# EAGLE design Atividade-03 (EAGLE 9.6.2)
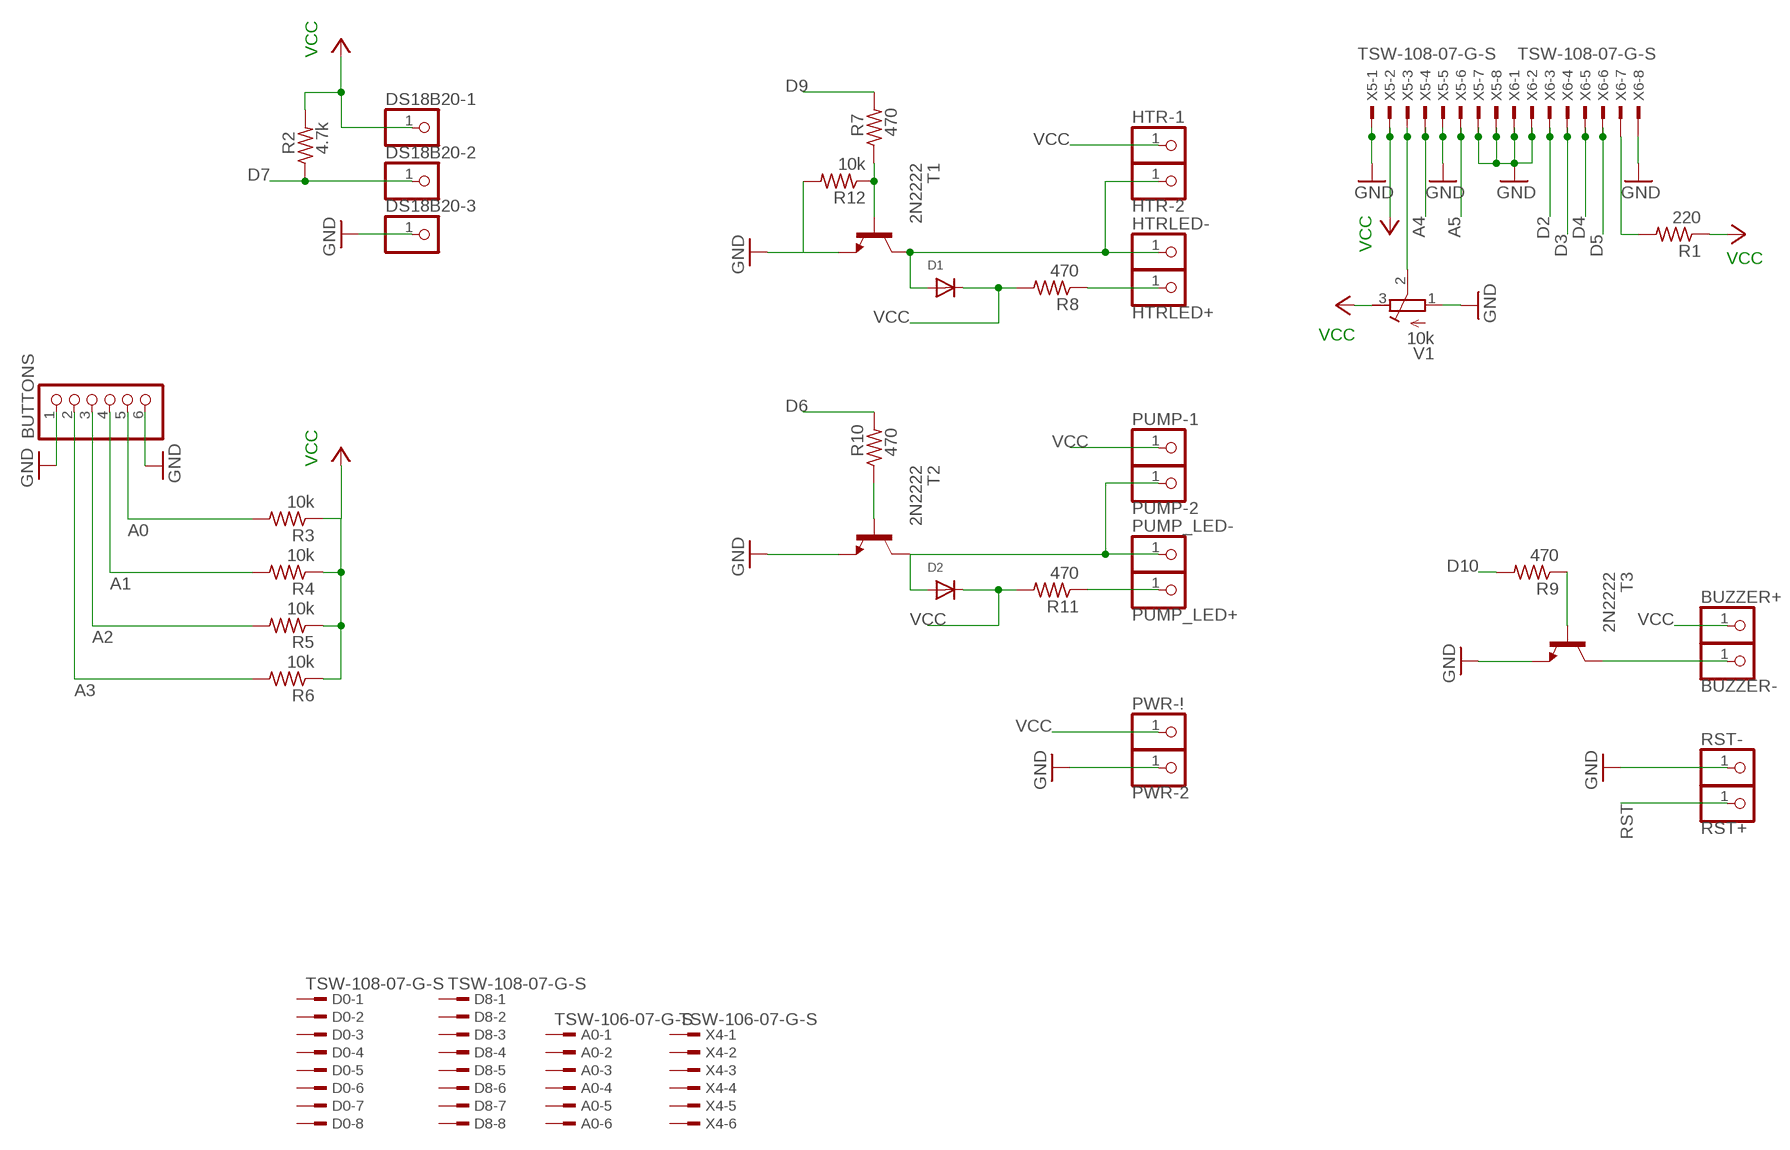
[diagram p0: schematic, sheet 1]

## Parts
A0  TSW-106-07-G-S  [TSW-106-XX-G-S]
BUTTONS  PINHD-1X6  [1X06]
BUZZER+  PINHD-1X1  [1X01]
BUZZER-  PINHD-1X1  [1X01]
D0  TSW-108-07-G-S  [TSW-108-XX-G-S]
D1  DIODEDO-1N4148  [DO-1N4148]
D2  DIODEDO-1N4148  [DO-1N4148]
D8  TSW-108-07-G-S  [TSW-108-XX-G-S]
DS18B20-1  PINHD-1X1  [1X01]
DS18B20-2  PINHD-1X1  [1X01]
DS18B20-3  PINHD-1X1  [1X01]
HTR-1  PINHD-1X1  [1X01]
HTR-2  PINHD-1X1  [1X01]
HTRLED+  PINHD-1X1  [1X01]
HTRLED-  PINHD-1X1  [1X01]
PUMP-1  PINHD-1X1  [1X01]
PUMP-2  PINHD-1X1  [1X01]
PUMP_LED+  PINHD-1X1  [1X01]
PUMP_LED-  PINHD-1X1  [1X01]
PWR-2  PINHD-1X1  [1X01]
PWR-!  PINHD-1X1  [1X01]
R1  220  R-US_0207/7  [0207/7]
R2  4.7k  R-US_0207/7  [0207/7]
R3  10k  R-US_0207/7  [0207/7]
R4  10k  R-US_0207/7  [0207/7]
R5  10k  R-US_0207/7  [0207/7]
R6  10k  R-US_0207/7  [0207/7]
R7  470  R-US_0207/7  [0207/7]
R8  470  R-US_0207/7  [0207/7]
R9  470  R-US_0207/7  [0207/7]
R10  470  R-US_0207/7  [0207/7]
R11  470  R-US_0207/7  [0207/7]
R12  10k  R-US_0207/7  [0207/7]
RST+  PINHD-1X1  [1X01]
RST-  PINHD-1X1  [1X01]
T1  2N2222  [TO92-EBC-OVAL]
T2  2N2222  [TO92-EBC-OVAL]
T3  2N2222  [TO92-EBC-OVAL]
V1  10k  R-TRIMM5W  [RTRIM5W]
X4  TSW-106-07-G-S  [TSW-106-XX-G-S]
X5  TSW-108-07-G-S  [TSW-108-XX-G-S]
X6  TSW-108-07-G-S  [TSW-108-XX-G-S]

## Nets
A0: BUTTONS.5 R3.2
A1: BUTTONS.4 R4.2
A2: BUTTONS.3 R5.2
A3: BUTTONS.2 R6.2
A4: X5.4
A5: X5.6
D2: X6.3
D3: X6.4
D4: X6.5
D5: X6.6
D6: R10.2
D7: DS18B20-2.1 R2.1
D9: R7.2
D10: R9.2
GND: BUTTONS.1 BUTTONS.6 DS18B20-3.1 PWR-2.1 R12.2 RST-.1 T1.E T2.E T3.E V1.1(A) X5.1 X5.5 X5.7 X5.8 X6.1 X6.2 X6.8
N$1: V1.2(S) X5.3
N$2: R7.1 R12.1 T1.B
N$3: D1.A D2.A HTR-2.1 HTRLED-.1 PUMP-2.1 PUMP_LED-.1 T1.C T2.C
N$4: R10.1 T2.B
N$5: HTRLED+.1 PUMP_LED+.1 R8.1 R11.1
N$6: R9.1 T3.B
N$7: BUZZER-.1 T3.C
N$8: R1.2 X6.7
RST: RST+.1
VCC: BUZZER+.1 D1.C D2.C DS18B20-1.1 HTR-1.1 PUMP-1.1 PWR-!.1 R1.1 R2.2 R3.1 R4.1 R5.1 R6.1 R8.2 R11.2 V1.3(E) X5.2
Unconnected: A0.1 A0.2 A0.3 A0.4 A0.5 A0.6 D0.1 D0.2 D0.3 D0.4 D0.5 D0.6 D0.7 D0.8 D8.1 D8.2 D8.3 D8.4 D8.5 D8.6 D8.7 D8.8 X4.1 X4.2 X4.3 X4.4 X4.5 X4.6

## Library data of the parts
A0 X4 = con-samtec:TSW-106-*-G-S: THROUGH-HOLE .025" SQ POST HEADER Source: Samtec TSW.pdf; MF: Samtec Inc.; MPN: TSW-106-07-G-S
BUTTONS = adafruit:PINHD-1X6: PIN HEADER
BUZZER+ BUZZER- DS18B20-1-DS18B20-3 HTR-1 HTR-2 HTRLED+ HTRLED- PUMP-1 PUMP-2 PUMP_LED+ PUMP_LED- PWR-2 PWR-! RST+ RST- = adafruit:PINHD-1X1: Pin header 1x1 for 0.1" spacing With round pins
D0 D8 X5 X6 = con-samtec:TSW-108-*-G-S: THROUGH-HOLE .025" SQ POST HEADER Source: Samtec TSW.pdf; MF: Samtec Inc.; MPN: TSW-108-07-G-S
D1 D2 = adafruit:DIODE: Diode SMADIODE - SMA Surface Mount Package 20V 1A Schottky Diode Digikey: 641-1014-6-ND DO-1N4148 - Through Hole Small Current Diode SOD-123 20V 1 A (.5mV Vf) Schottky Diode - Digikey: MBRX120TPMSCT-ND SOD-323 10V 570mA (.38mV Vf, 3ns) Schottky Diode - Digikey: ZLLS410CT-ND SOD-523 30V 30mA Schottky Diode (RB751S-40TE61) - Digikey: RB751S-40TE61CT-ND SOT23-R/W - SOT23 Package (R = Solder Paste/Reflow Ovens, W = Hand-Soldering) BAT54Film 40V 300mA - Digikey: 497-7162-1-ND
R1-R12 = resistor:R-US_: RESISTOR, American symbol
T1-T3 = adafruit:2N2222: NPN TRANSISTOR Big oval pads
V1 = resistor:R-TRIMM: Trimm resistor

## Board
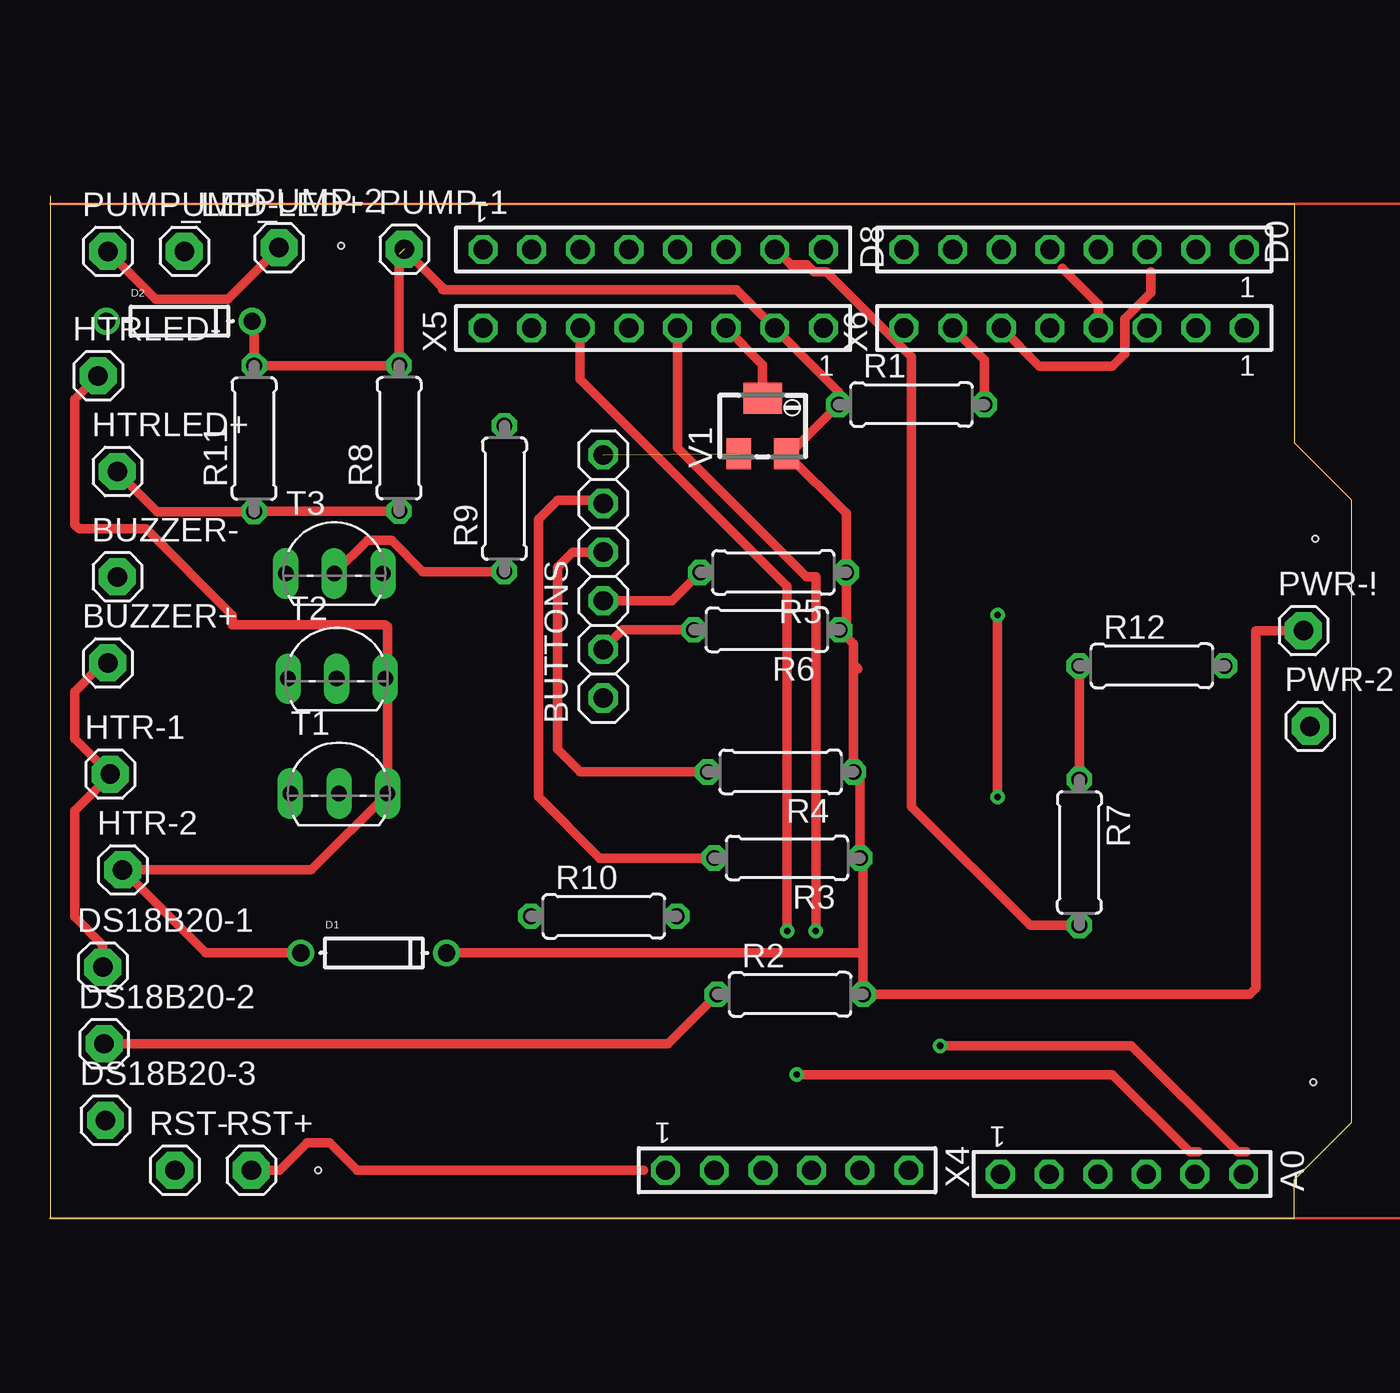
[diagram p1: board, top side]
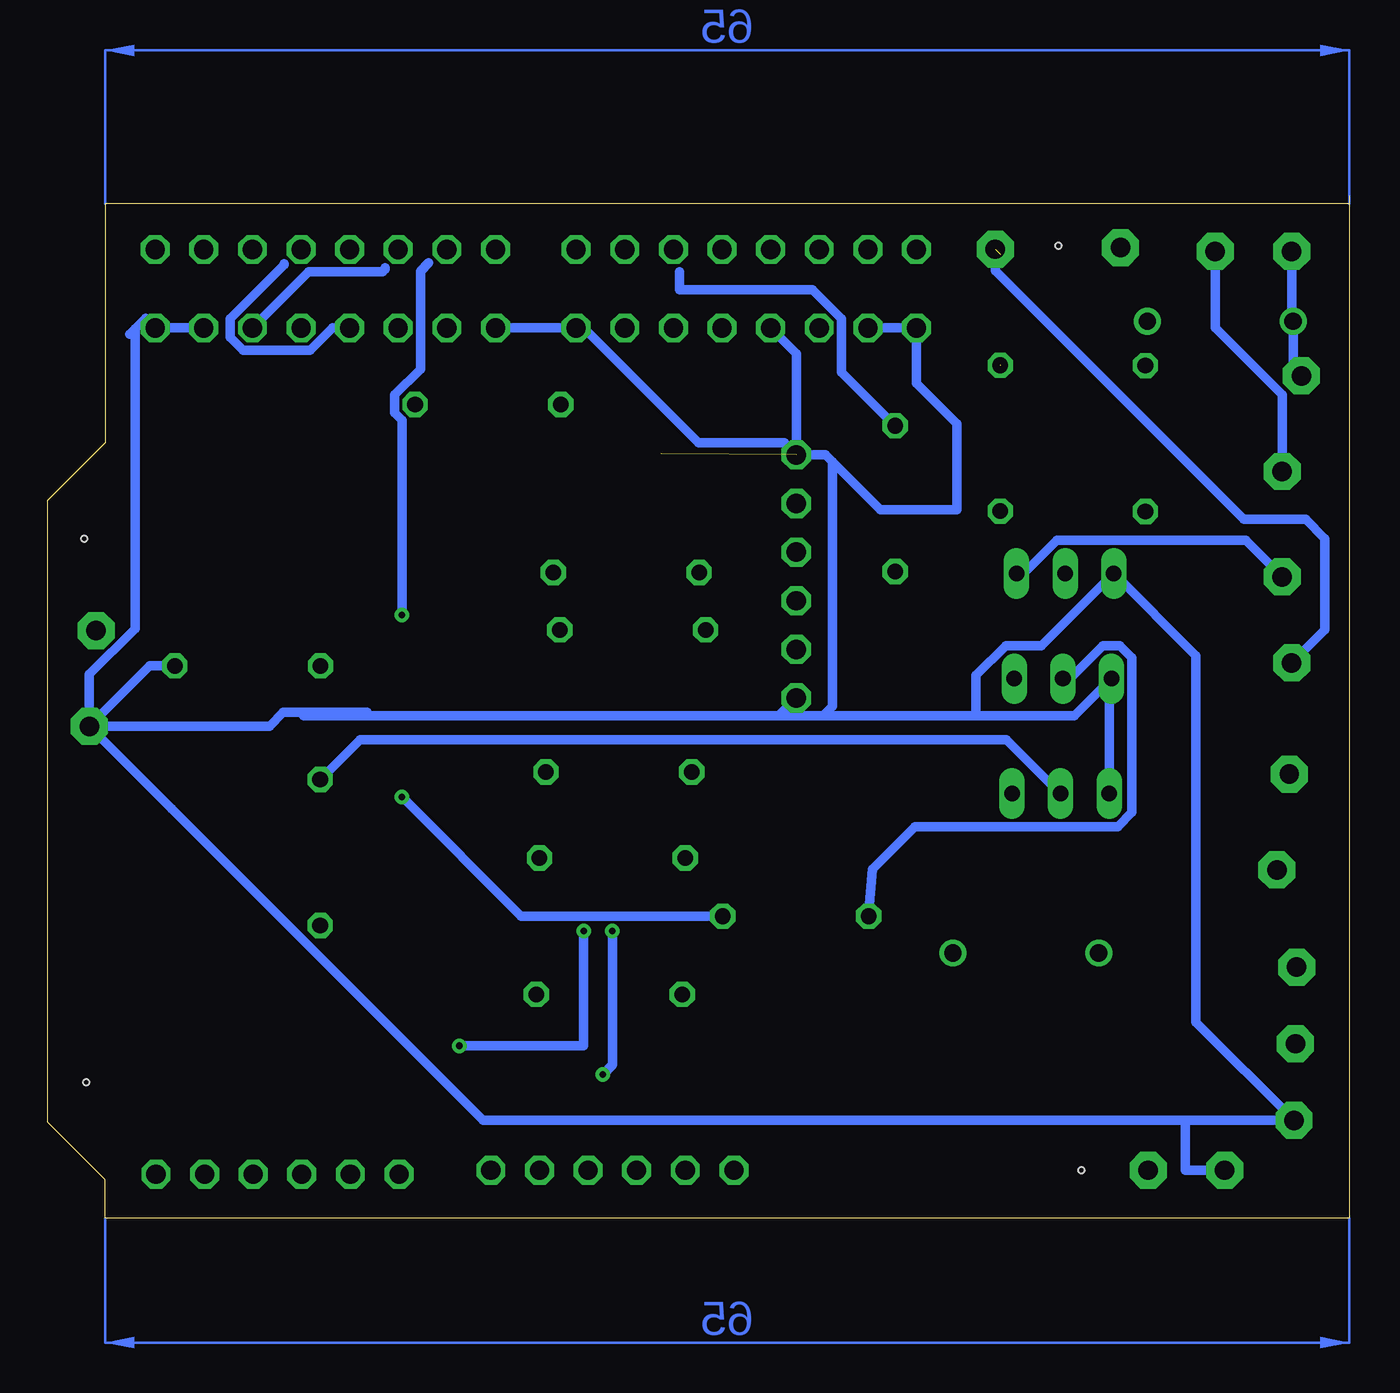
[diagram p2: board, bottom side, seen from below]

Size 68 x 53.4 mm. Coordinates in mm from the lower left corner, seen from the top.
Outline: 0,53.28 0,53
Outline: 0,53 0,0 65,0 65,2 68,5 68,37.5 65,40.5 65,53 0,53
Outline: 0,53.4 0,53
Copper layers (1*16): Top 0.035mm / dielectric 1.5mm / Bottom 0.035mm
Design rules "default": minimum track width 6mil, minimum drill 0.35mm, track to track 6mil, track to pad 6mil, pad to pad 6mil, via to via 6mil, smd to smd 6mil, copper to edge 40mil, drill to drill 6mil, minimum pad ring 10mil, minimum via ring 8mil, stop-mask expansion 4mil, vias tented up to drill 0mil, thermal gap 10mil
Holes 0.32 mm at 66.1,35.5 66,7.1 14,2.5 15.2,50.8

### Footprints (pad centres in the part's own frame; a part is rotated, then mirrored left to right if it is on the bottom)
TSW-106-XX-G-S = drill 1 pad 1.5 octagon: 1 6.35,0; 2 3.81,0; 3 1.27,0; 4 -1.27,0; 5 -3.81,0; 6 -6.35,0
1X06 = drill 1.016 octagon: 1 -6.35,0; 2 -3.81,0; 3 -1.27,0; 4 1.27,0; 5 3.81,0; 6 6.35,0
1X01 = drill 1.016 pad 1.93 octagon: 1 0,0
TSW-108-XX-G-S = drill 1 pad 1.5 octagon: 1 8.89,0; 2 6.35,0; 3 3.81,0; 4 1.27,0; 5 -1.27,0; 6 -3.81,0; 7 -6.35,0; 8 -8.89,0
DO-1N4148 = drill 0.9: A -3.81,0; C 3.81,0
0207/7 = drill 0.813 octagon: 1 -3.81,0; 2 3.81,0
TO92-EBC-OVAL = drill 0.813 long: B 0,-1.27; C 2.54,-1.27; E -2.54,-1.27
RTRIM5W = smd 1.3 x 1.6: 1 -1.25,-1.45; 3 1.25,-1.45 | smd 2 x 1.6: 2 0,1.45

### Placement (x,y rotation side)
A0  56,2.3 180 top
BUTTONS  28.89,33.52 90 top
BUZZER+  3,29 0 top
BUZZER-  3.5,33.5 0 top
D0  53.5,50.6 0 top
D1  16.9,13.85 0 top
D2  6.74,46.85 0 top
D8  31.5,50.6 180 top
DS18B20-1  2.74,13.11 0 top
DS18B20-2  2.81,9.11 0 top
DS18B20-3  2.88,5.11 0 top
HTR-1  3.13,23.19 0 top
HTR-2  3.78,18.19 0 top
HTRLED+  3.5,39 0 top
HTRLED-  2.5,44 0 top
PUMP-1  18.49,50.61 0 top
PUMP-2  11.95,50.69 0 top
PUMP_LED+  7,50.5 0 top
PUMP_LED-  3,50.5 0 top
PWR-2  65.83,25.69 0 top
PWR-!  65.48,30.69 0 top
R1  45,42.5 0 top
R2  38.66,11.69 0 top
R3  38.5,18.81 180 top
R4  38.16,23.31 180 top
R5  37.78,33.73 180 top
R6  37.44,30.73 180 top
R7  53.77,19.1 270 top
R8  18.23,40.74 90 top
R9  23.73,37.58 90 top
R10  28.92,15.77 0 top
R11  10.65,40.72 90 top
R12  57.56,28.85 0 top
RST+  10.5,2.5 0 top
RST-  6.5,2.5 0 top
T1  15.08,23.45 0 top
T2  14.96,29.45 0 top
T3  14.84,34.95 0 top
V1  37.22,41.38 0 top
X4  38.5,2.5 180 top
X5  31.5,46.5 0 top
X6  53.5,46.5 0 top

### Tracks (layer width: path | path; a pad name or v marks a point on that pad's centre or on a via)
A0
  Top 0.508: R3.2 28.69,18.81 25.5,22 25.5,36.5 26.5,37.5 28.72,37.5 BUTTONS.5
A1
  Top 0.508: R4.2 27.69,23.31 26.5,24.5 26.5,34 27.29,34.79 BUTTONS.4
A2
  Top 0.508: R5.2 32.49,32.25 BUTTONS.3
A3
  Top 0.508: R6.2 29.91,30.73 BUTTONS.2
A4  (via drill 0.35)
  Top 0.508: X5.4 32.77,40.23 39.5,33.5 40,33.5 v40,15 | v46.5,9 56.5,9 62.04,3.46 62.5,3.46
  Bottom 0.508: v40,15 40,9 v46.5,9
A5  (via drill 0.35)
  Top 0.508: X5.6 27.69,43.81 38.5,33 v38.5,15 | v39,7.5 55.5,7.5 59.54,3.46 60,3.46
  Bottom 0.508: v38.5,15 38.5,8 v39,7.5
D2
  Bottom 0.508: X6.3 54.37,49.44 50.5,49.44 | 50.5,49.44 | 50.5,49.44 50.37,49.57 50.37,49.63
D3
  Top 0.508: X6.4 54.77,47.73 52.89,49.61
D4
  Bottom 0.508: 55.66,49.84 55.66,49.8 58.47,46.98 58.47,46.02 57.79,45.34 54.29,45.34 53.13,46.5 X6.5
D5
  Top 0.508: X6.6 51.69,44.5 55.5,44.5 56.15,45.15 56.15,46.98 57.5,48.33 57.5,49.44
D6  (via drill 0.35)
  Top 0.508: v49.5,22 v49.5,31.5
  Bottom 0.508: R10.2 43.27,15.77 v49.5,22 | v49.5,31.5 49.5,41.68 49.88,42.06 49.88,43 48.53,44.35 48.53,47.02 48.53,49.47 48.1,49.9
D7
  Top 0.508: DS18B20-2.1 32.27,9.11 R2.1
D9
  Top 0.508: R7.2 51.21,15.29 45,21.5 45,45 40.56,49.44 39.91,49.44 39.54,49.8 39,49.8 38.7,49.8 38,50.5
D10
  Bottom 0.508: R9.2 26.53,44.19 26.53,46.98 28.05,48.5 35,48.5 35,49.44
GND  (1 unrouted)
  Bottom 0.508: R12.2 62.67,28.85 PWR-2.1 | 63.73,46.16 63.45,46.45 | 63.45,46.45 62.89,47 X6.1 X6.2 | PWR-2.1 65.83,28.4 63.45,30.79 63.45,46.45 | 29.82,26.24 54.63,26.24 54.81,26.42 | 29.82,26.24 BUTTONS.1 | PWR-2.1 61.52,21.38 | 19.5,26.24 14.36,26.24 T2.E 12.54,28.06 T1.E | 29.82,26.24 27.5,26.24 | 27.5,26.24 19.5,26.24 | PWR-2.1 45.25,5.11 8.5,5.11 | 8.5,5.11 DS18B20-3.1 8,10.23 8,29.38 T3.E 16.07,29.91 17.94,29.91 19.5,28.35 19.5,26.24 | RST-.1 8.56,2.5 8.56,5.05 8.5,5.11 | 54.81,26.42 55.69,26.42 56.42,25.69 PWR-2.1 | 54.81,26.42 51.31,26.42 | BUTTONS.6 28.89,45.16 X5.5 | X6.8 X5.1 40,46.5 34,40.5 29.52,40.5 BUTTONS.6 | BUTTONS.6 27.37,39.87 27,39.5 | 27,39.5 27,26.74 27.5,26.24 | X5.7 X5.8 22.61,43.61 20.5,41.5 20.5,37 24.5,37 27,39.5
N$1
  Top 0.508: V1.2 37.22,44.59 X5.3
N$2
  Top 0.508: R7.1 53.77,28.83 R12.1
  Bottom 0.508: T1.B 17.9,25 51.68,25 R7.1
N$3
  Top 0.508: D1.A 8.12,13.85 HTR-2.1 13.63,18.19 T1.C 17.62,28.06 | 17.62,28.06 T2.C | PUMP_LED-.1 5.5,48 9.26,48 PUMP-2.1 | HTRLED-.1 1.27,42.77 1.27,36.23 1.5,36 5,36 9.5,31.5 9.5,31 17.5,31 17.62,30.88 17.62,28.06
  Bottom 0.508: PUMP_LED-.1 3,46.92 D2.A 2.93,44.43 HTRLED-.1
N$4
  Bottom 0.508: R10.1 24.91,18.23 22.69,20.45 12.1,20.45 11.35,21.2 11.35,29.28 11.98,29.91 12.86,29.91 14.59,28.18 T2.B
N$5
  Top 0.508: R8.1 10.67,36.93 R11.1 5.59,36.91 HTRLED+.1
  Bottom 0.508: PUMP_LED+.1 7,46.5 3.5,43 HTRLED+.1
N$6
  Top 0.508: R9.1 19.46,33.77 17.82,35.41 16.57,35.41 T3.B
N$7
  Bottom 0.508: T3.C 17.01,33.68 15.28,35.41 5.41,35.41 BUZZER-.1
N$8
  Top 0.508: R1.2 48.81,44.84 X6.7
RST
  Top 0.508: RST+.1 11.98,2.5 13.41,3.93 14.59,3.93 16.02,2.5 30.99,2.5
VCC  (2 unrouted)
  Top 0.508: 42.47,14 42.47,18.65 R3.1 42.31,22.97 R4.1 41.97,28.85 | 42.47,14 R2.2 62.69,11.69 63,12 63,30.69 PWR-!.1 | 41.97,28.85 42,28.88 42.19,28.69 | 41.97,28.85 41.97,30.01 R6.1 41.59,31.07 R5.1 41.59,36.81 V1.3 38.62,39.93 R1.1 41.19,43.16 X5.2 35.85,48.5 20.5,48.5 20.5,48.6 PUMP-1.1 | BUZZER+.1 3.13,28.87 2.64,28.87 1.27,27.5 1.27,25.05 HTR-1.1 3.13,23.13 1.27,21.27 1.27,15.73 2.74,14.26 DS18B20-1.1 | R8.2 18.23,50.35 | 18.21,44.53 R11.2 10.65,46.85 D2.C | D1.C 42.32,13.85 42.47,14
  Bottom 0.508: BUZZER+.1 1.27,30.73 1.27,35.5 2.27,36.5 5.5,36.5 18.49,49.49 PUMP-1.1
(copper drawn outside any net)
  shapes: Bottom area x2, Top area x1